# EAGLE schematic Smartenit_Board_Updated (EAGLE 8.4.1)
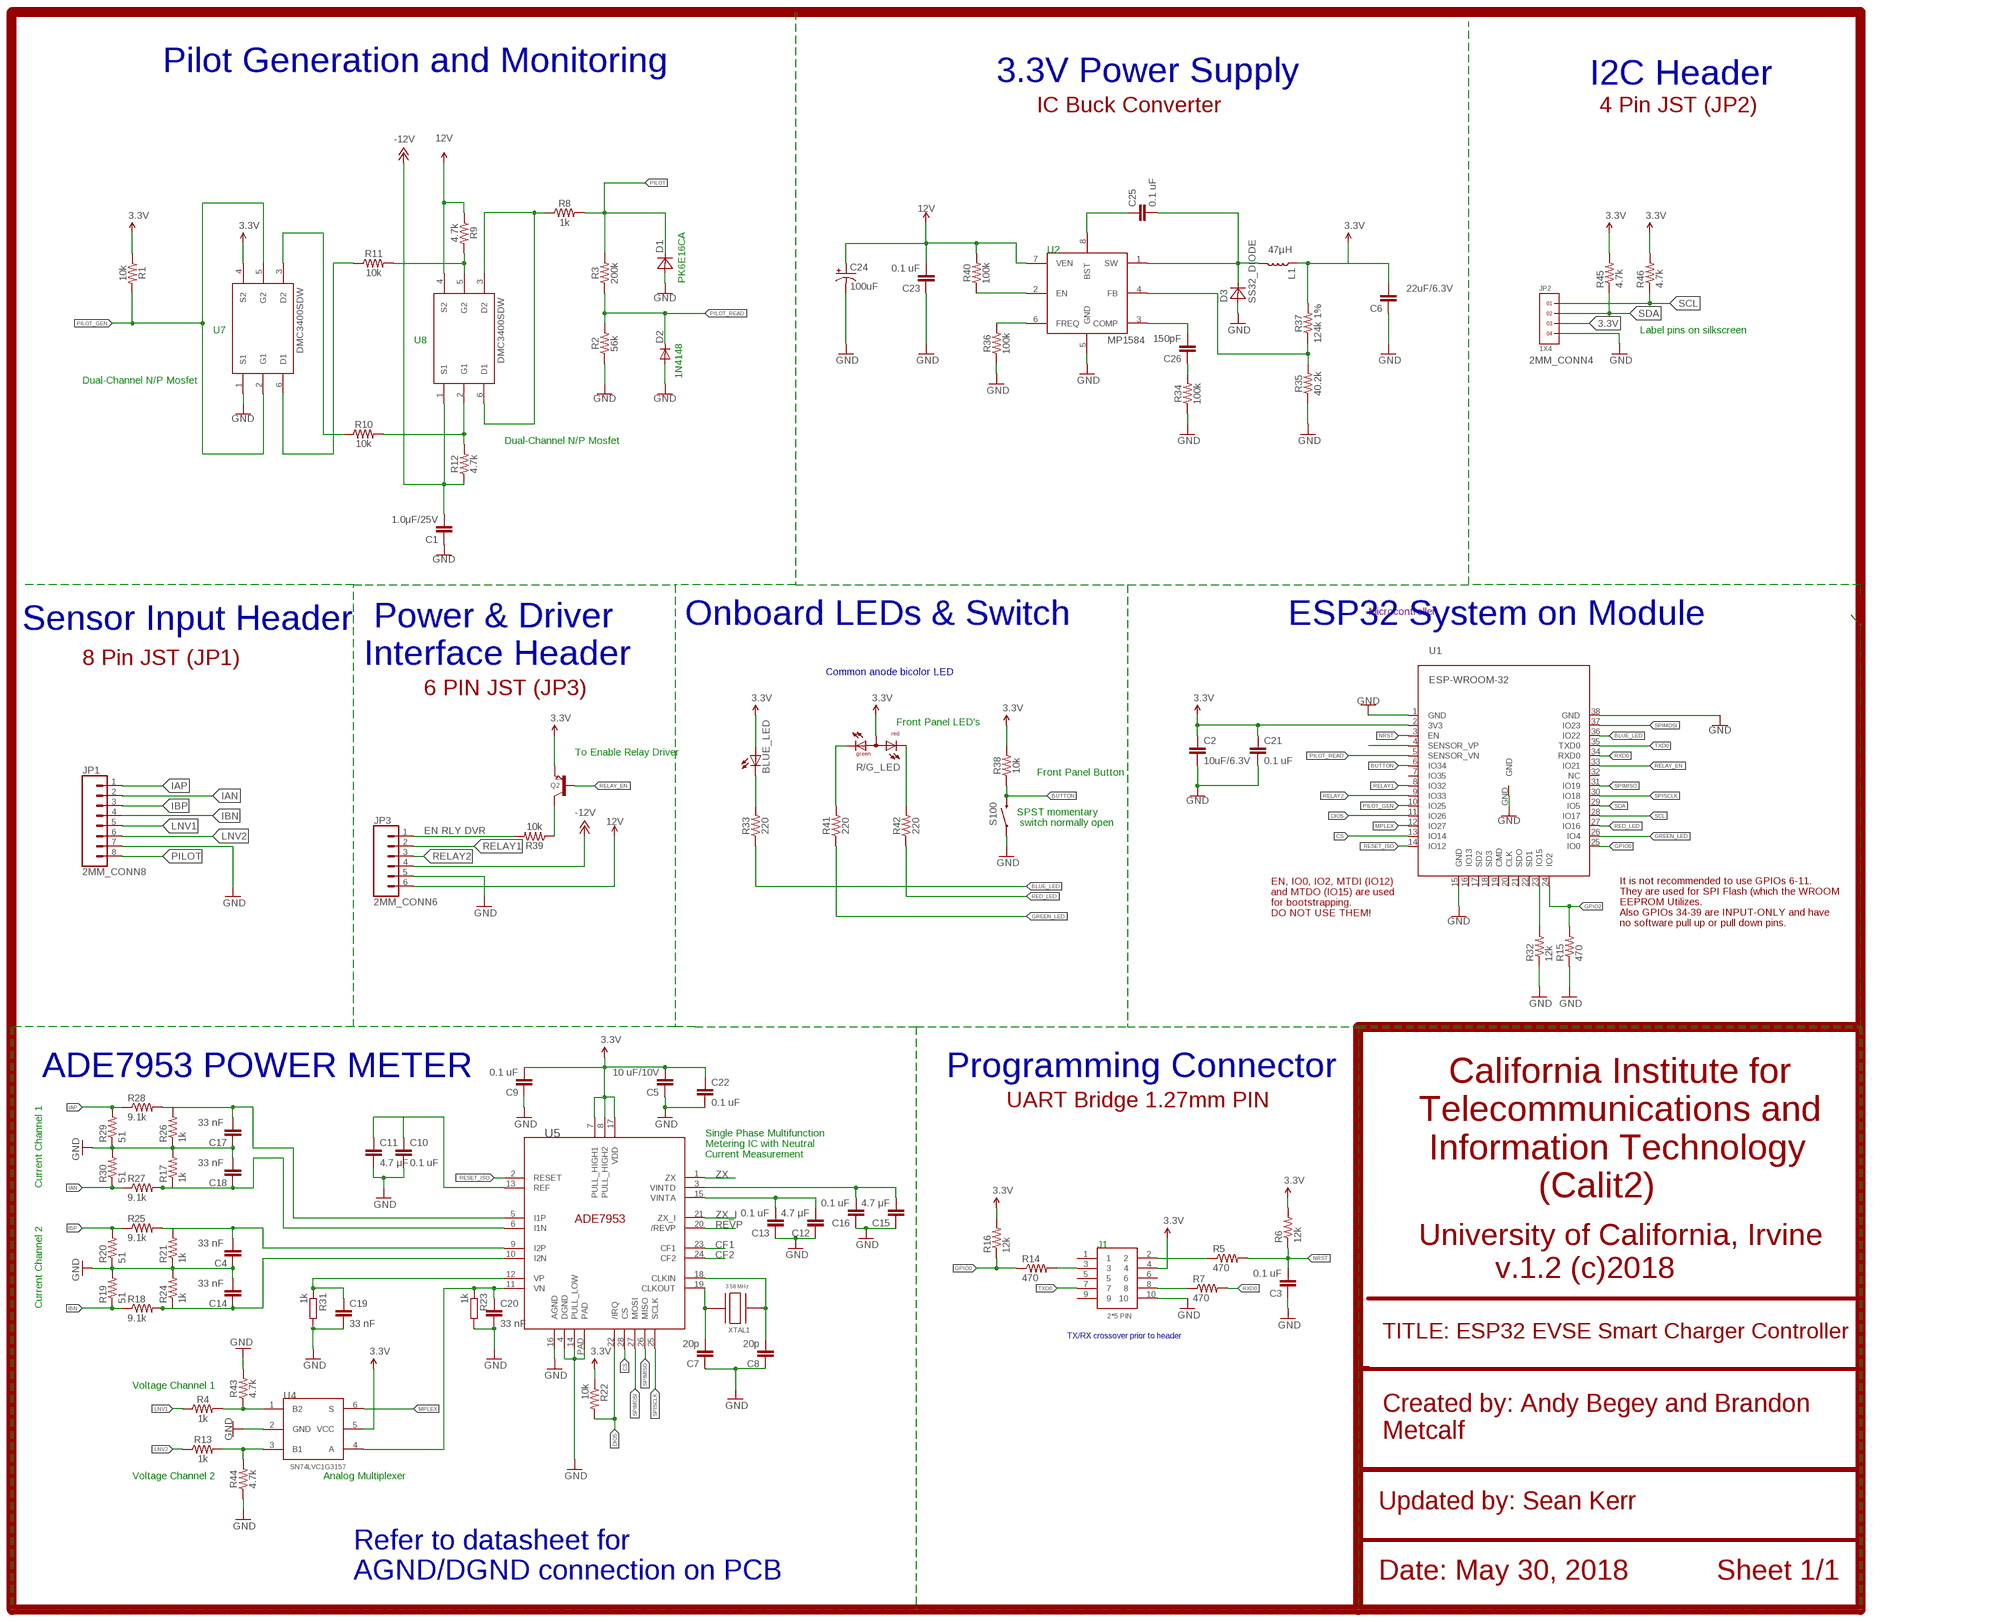
[diagram p0: schematic, sheet 1]

## Parts
BLUE_LED  LED3MM  [LED3MM]
C1  1.0μF/25V  680PF-0603-50V-10%  [0603]
C2  10uF/6.3V  CAP0805  [0805]
C3  0.1 uF  0402-CAP  [0402-CAP]
C4  33 nF  0402-CAP  [0402-CAP]
C5  10 uF/10V  0402-CAP  [0402-CAP]
C6  22uF/6.3V  680PF-0603-50V-10%  [0603]
C7  20p  0402-CAP  [0402-CAP]
C8  20p  0402-CAP  [0402-CAP]
C9  0.1 uF  0402-CAP  [0402-CAP]
C10  0.1 uF  0402-CAP  [0402-CAP]
C11  4.7 μF  0402-CAP  [0402-CAP]
C12  4.7 μF  0402-CAP  [0402-CAP]
C13  0.1 uF  0402-CAP  [0402-CAP]
C14  33 nF  0402-CAP  [0402-CAP]
C15  4.7 μF  0402-CAP  [0402-CAP]
C16  0.1 uF  0402-CAP  [0402-CAP]
C17  33 nF  0402-CAP  [0402-CAP]
C18  33 nF  0402-CAP  [0402-CAP]
C19  33 nF  C-EUC0805K  [C0805K]
C20  33 nF  C-EUC0805K  [C0805K]
C21  0.1 uF  CAP0603-CAP  [0603-CAP]
C22  0.1 uF  10UF-0805-10V-10%  [0805]
C23  0.1 uF  680PF-0603-50V-10%  [0603]
C24  100uF  CAP_POLPTH1  [CPOL-RADIAL-100UF-25V]
C25  0.1 uF  680PF-0603-50V-10%  [0603]
C26  150pF  680PF-0603-50V-10%  [0603]
D1  P6SMB16A  TVSDIODE  [D014AC]
D2  DIODESOD  [SOD-323]
D3  SS32_DIODE  [D0-214AB]
J1  2X5CONNECTOR1.27MM  [1296-10]
JP1  2MM_CONN8  [CONN82MM]
JP2  1X4  [1X4]
JP3  2MM_CONN6  [CONN6_2MM]
L1  47µH/±30%/750mA  INDUCTOR-CR54-47UH  [CR54]
Q2  PNP-TRANSISTOR_SOT23  [SOT23]
R1  10k  100KOHM-0603-1/10W-1%  [0603]
R2  56k  100KOHM-0603-1/10W-1%  [0603]
R3  200k  100KOHM-0603-1/10W-1%  [0603]
R4  1k  1KOHM-0603-1/10W-1%  [0603]
R5  470  0402-RES  [0402-RES]
R6  12k  0402-RES  [0402-RES]
R7  470  0402-RES  [0402-RES]
R8  1k  100KOHM-0603-1/10W-1%  [0603]
R9  4.7k  100KOHM-0603-1/10W-1%  [0603]
R10  10k  100KOHM-0603-1/10W-1%  [0603]
R11  10k  100KOHM-0603-1/10W-1%  [0603]
R12  4.7k  100KOHM-0603-1/10W-1%  [0603]
R13  1k  1KOHM-0603-1/10W-1%  [0603]
R14  470  0402-RES  [0402-RES]
R15  470  0402-RES  [0402-RES]
R16  12k  0402-RES  [0402-RES]
R17  1k  0402-RES  [0402-RES]
R18  9.1k  0402-RES  [0402-RES]
R19  51  0402-RES  [0402-RES]
R20  51  0402-RES  [0402-RES]
R21  1k  0402-RES  [0402-RES]
R22  10k  0402-RES  [0402-RES]
R23  1k  R-EU_0204/2V  [0204V]
R24  1k  0402-RES  [0402-RES]
R25  9.1k  0402-RES  [0402-RES]
R26  1k  0402-RES  [0402-RES]
R27  9.1k  0402-RES  [0402-RES]
R28  9.1k  0402-RES  [0402-RES]
R29  51  0402-RES  [0402-RES]
R30  51  0402-RES  [0402-RES]
R31  1k  R-EU_0204/2V  [0204V]
R32  12k  0402-RES  [0402-RES]
R33  220  10KOHM-0603-1/10W-1%  [0603]
R34  100k  100KOHM-0603-1/10W-1%  [0603]
R35  40.2k  100KOHM-0603-1/10W-1%  [0603]
R36  100k  100KOHM-0603-1/10W-1%  [0603]
R37  124k 1%  100KOHM-0603-1/10W-1%  [0603]
R38  10k  10KOHM-0603-1/10W-1%  [0603]
R39  10k  100KOHM-0603-1/10W-1%  [0603]
R40  100k  100KOHM-0603-1/10W-1%  [0603]
R41  220  10KOHM-0603-1/10W-1%  [0603]
R42  220  10KOHM-0603-1/10W-1%  [0603]
R43  4.7k  1KOHM-0603-1/10W-1%  [0603]
R44  4.7k  1KOHM-0603-1/10W-1%  [0603]
R45  4.7k  0402-RES  [0402-RES]
R46  4.7k  0402-RES  [0402-RES]
R/G_LED  DUOLED-RG-A  [DUOLED-A-5MM]
S100  SWITCH-MOMENTARY-2PTH  [TACTILE-PTH]
U1  ESP-WROOM-32  [ESP-WROOM-32]
U2  MP1584  [SOIC8]
U4  SN74LVC1G3157  [DBV-6]
U5  ADE7953  [28-WFQFN]
U7  DMC3400SSDW  [SOT363]
U55  DMC3400SSDW  [SOT363]
XTAL1  QUARTZ_3.58M_2PIN  [HC-49S]

## Nets
3.3V: BLUE_LED.A C2.1 C5.2 C6.2 C9.2 C21.1 C22.1 J1.4 JP2.3 L1.P$1 Q2.2(E) R1.1 R6.2 R16.2 R22.1 R37.2 R38.2 R45.2 R46.2 R/G_LED.A U1.2(3V3) U4.5(VCC) U5.7(PULL_HIGH1) U5.8(PULL_HIGH2) U5.17(VDD) U7.4(S2)
12V: C23.2 C24.1(+) JP3.6(PIN6) R9.1 R40.2 U2.7(VEN) U55.4(S2)
-12V: C1.2 JP3.4(PIN4) R12.1 U55.1(S1)
AGND: C4.1 C10.2 C11.2 C12.1 C13.1 C14.2 C17.1 C18.2 C19.2 C20.2 R17.2 R19.2 R20.1 R21.1 R23.2 R24.2 R26.1 R29.1 R30.2 R31.2 U4.2(GND) U5.16(AGND) ; supply symbol labelled GND
BLUE_LED: R33.1 U1.36(IO22)
BUTTON: R38.1 S100.3 U1.6(IO34)
CF1: U5.23(CF1)
CF2: U5.24(CF2)
CS: U1.13(IO14) U5.28(CS)
DGND: C1.1 C2.2 C3.1 C5.1 C6.1 C7.1 C8.1 C9.1 C15.1 C16.1 C21.2 C22.2 C23.1 C24.2(-) D1.P D2.2(A) J1.10 JP3.5(PIN5) R2.1 R15.1 R32.1 R34.1 R35.1 R36.1 R43.2 R44.1 S100.1 U1.1(GND) U1.15(GND) U1.GND U2.5(GND) U5.4(DGND) U5.14(PULL_LOW) U5.PAD U7.1(S1) ; supply symbol labelled GND
DIO5: R22.2 U1.11(IO26) U5.22(/IRQ)
FRGGN: R32.2 U1.23(IO15)
GND: D3.P JP1.7 JP2.4 U1.38(GND)
GPIO0: R14.1 R16.1 U1.25(IO0)
GPIO2: R15.2 U1.24(IO2)
GREEN_LED: R41.1 U1.26(IO4)
IAN: JP1.2 R27.1 R30.1
IAP: JP1.1 R28.1 R29.2
IBN: JP1.4 R18.1 R19.1
IBP: JP1.3 R20.2 R25.1
LNV1: JP1.5 R4.1
LNV2: JP1.6 R13.1
MPLEX: U1.12(IO27) U4.6(S)
N$1: C7.2 U5.19(CLKOUT) XTAL1.1
N$2: C8.2 U5.18(CLKIN) XTAL1.2
N$3 [ic]: C20.1 R23.1 U4.4(A) U5.11(VN)
N$4: R36.2 U2.6(FREQ)
N$5: C4.2 R21.2 R25.2 U5.9(I2P)
N$7: C10.1 C11.1 U5.13(REF)
N$8: C12.2 C13.2 U5.15(VINTA)
N$10: R4.2 R43.1 U4.1(B2)
N$11: C14.1 R18.2 R24.1 U5.10(I2N)
N$12: C15.2 C16.2 U5.3(VINTD)
N$13: R13.2 R44.2 U4.3(B1)
N$14: R40.1 U2.2(EN)
N$15: C26.2 U2.3(COMP)
N$17: C26.1 R34.2
N$18: C25.2 D3.N L1.P$2 U2.1(SW)
N$19: R35.2 R37.1 U2.4(FB)
N$20: Q2.3(C) R39.1
N$21: BLUE_LED.K(C) R33.2
N$22: C25.1 U2.8(BST)
N$23: R9.2 R11.2 U55.5(G2)
N$24: C17.2 R26.2 R28.2 U5.5(I1P)
N$25: R41.2 R/G_LED.CX(CG)
N$26: R42.2 R/G_LED.CR
N$27: C18.1 R17.1 R27.2 U5.6(I1N)
N$28: R10.1 U7.3(D2)
N$29: R10.2 R12.2 U55.2(G1)
N$32: R11.1 U7.6(D1)
N$33: R8.1 U55.3(D2) U55.6(D1)
N$38: JP3.1(PIN1) R39.2
N$40: J1.3 R14.2
N$47: U1.4(SENSOR_VP)
N$62: J1.2 R5.1
N$65: J1.8 R7.1
NRST: C3.2 R5.2 R6.1 U1.3(EN)
PILOT: D1.N JP1.8 R3.2 R8.2
PILOT_GEN: R1.2 U1.10(IO25) U7.2(G1) U7.5(G2)
PILOT_READ: D2.1(C) R2.2 R3.1 U1.5(SENSOR_VN)
RED_LED: R42.1 U1.27(IO16)
RELAY1: JP3.2(PIN2) U1.8(IO32)
RELAY2: JP3.3(PIN3) U1.9(IO33)
RELAY_EN: Q2.1(B) U1.33(IO21)
RESET_ISO: U1.14(IO12) U5.2(RESET)
REVP: U5.20(/REVP)
RXD0: R7.2 U1.34(RXD0)
SCL: JP2.1 R46.1 U1.28(IO17)
SDA: JP2.2 R45.1 U1.29(IO5)
SPIMISO: U1.31(IO19) U5.26(MISO)
SPIMOSI: U1.37(IO23) U5.27(MOSI)
SPISCLK: U1.30(IO18) U5.25(SCLK)
TXD0: J1.7 U1.35(TXD0)
V2P [ic]: C19.1 R31.1 U5.12(VP)
ZX: U5.1(ZX)
ZX_I: U5.21(ZX_I)
Unconnected: J1.1 J1.5 J1.6 J1.9 U1.7(IO35) U1.16(IO13) U1.17(SD2) U1.18(SD3) U1.19(CMD) U1.20(CLK) U1.21(SDO) U1.22(SD1) U1.32(NC)

## Notes on the sheet
- Pilot Generation and Monitoring
- 3.3V Power Supply
- IC Buck Converter | 4 Pin JST (JP2)
- I2C Header
- U2 | 47µH
- PK6E16CA
- U7 | Label pins on silkscreen
- U8 | 1N4148
- 2MM_CONN4
- Dual-Channel N/P Mosfet
- Dual-Channel N/P Mosfet
- Microcontroller
- Onboard LEDs & Switch | ESP32 | ESP32 System on Module
- 8 Pin JST (JP1)
- Power & Driver 
  Interface Header
- Common anode bicolor LED
- 6 PIN JST (JP3)
- Sensor Input Header
- Front Panel LED's
- To Enable Relay Driver
- Front Panel Button
- Q2
- SPST momentary
   switch normally open
- EN RLY DVR
- EN, IO0, IO2, MTDI (IO12)
   and MTDO (IO15) are used
   for bootstrapping. 
   DO NOT USE THEM!
- It is not recommended to use GPIOs 6-11.
  They are used for SPI Flash (which the WROOM
  EEPROM Utilizes.
  Also GPIOs 34-39 are INPUT-ONLY and have
  no software pull up or pull down pins.
- ADE7953 POWER METER | Programming Connector
- UART Bridge 1.27mm PIN
- Single Phase Multifunction
  Metering IC with Neutral
  Current Measurement
- Current Channel 1
- California Institute for
   Telecommunications and 
    Information Technology
               (Calit2)
- J1
- University of California, Irvine 
           v.1.2 (c)2018
- 3.58 MHz
- Current Channel 2
- TX/RX crossover prior to header | TITLE: ESP32 EVSE Smart Charger Controller
- Voltage Channel 1
- Created by: Andy Begey and Brandon 
  Metcalf
- Voltage Channel 2 | Analog Multiplexer
- Updated by: Sean Kerr
- Refer to datasheet for 
  AGND/DGND connection on PCB
- Date: May 30, 2018           Sheet 1/1

## Library data of the parts
BLUE_LED = SparkFun:LED: LEDs Standard schematic elements and footprints for 5mm, 3mm, 1206, and 0603 sized LEDs. 5mm - Spark Fun Electronics SKU : COM-00529 (and others)
C1 C6 C23 C25 C26 = SparkFun-Capacitors:680PF: 680pF/0.68nF ceramic capacitors A capacitor is a passive two-terminal electrical component used to store electrical energy temporarily in an electric field.; PROD_ID: CAP-09232; VALUE: 680pF
C2 C21 = SparkFun:CAP: Capacitor Standard 0603 ceramic capacitor, and 0.1" leaded capacitor.
C3-C5 C7-C18 = Nizanlib:0402-CAP
C19 C20 = resistor:C-EU: CAPACITOR, European symbol
C22 = SparkFun-Capacitors:10UF: 10.0µF ceramic capacitors A capacitor is a passive two-terminal electrical component used to store electrical energy temporarily in an electric field.; PROD_ID: CAP-11330; VALUE: 10uF
C24 = SparkFun:CAP_POL: Capacitor Polarized These are standard SMD and PTH capacitors. Normally 10uF, 47uF, and 100uF in electrolytic and tantalum varieties. Always verify the external diameter of the through hole cap, it varies with capacity, voltage, and manufacturer. The EIA devices should be standard.
D1 = Smart_Charger:TVSDIODE
D2 = SparkFun:DIODE: Diode These are standard reverse protection diodes and small signal diodes. SMA package can handle up to about 1A. SOD-323 can handle about 200mA. What the SOD-323 package when ordering, there are some mfgs out there that are 5-pin packages.
D3 = Smart_Charger:SS32_DIODE
J1 = Smart_Charger:2X5CONNECTOR1.27MM
JP1 = Smart_Charger:2MM_CONN8
JP2 = headers(2mm):1X4
JP3 = Smart_Charger:2MM_CONN6
L1 = SparkFun-Coils:INDUCTOR: Inductors Resist changes in electrical current. Basically a coil of wire. SparkFun Products: SparkFun Load Cell Amplifier - HX711 <https://www.sparkfun.com/products/13879> IOIO-OTG - V2.2 <https://www.sparkfun.com/products/13613>; PROD_ID: NDUC-10789
Q2 = semicon-smd-ipc:PNP-TRANSISTOR_: PNP TRANSISTOR
R1-R3 R8-R12 R35 R37 R39 = SparkFun-Resistors:100KOHM: 100kΩ resistor A resistor is a passive two-terminal electrical component that implements electrical resistance as a circuit element. Resistors act to reduce current flow, and, at the same time, act to lower voltage levels within circuits. - Wikipedia; PROD_ID: RES-07828; VALUE: 100k
R4 R13 = SparkFun-Resistors:1KOHM: 1kΩ resistor A resistor is a passive two-terminal electrical component that implements electrical resistance as a circuit element. Resistors act to reduce current flow, and, at the same time, act to lower voltage levels within circuits. - Wikipedia; PROD_ID: RES-07856
R5-R7 R14-R22 R24-R30 R32 R45 R46 = Nizanlib:0402-RES
R23 R31 = resistor:R-EU_: RESISTOR, European symbol
R33 R41 R42 = SparkFun-Resistors:10KOHM: 10kΩ resistor A resistor is a passive two-terminal electrical component that implements electrical resistance as a circuit element. Resistors act to reduce current flow, and, at the same time, act to lower voltage levels within circuits. - Wikipedia; PROD_ID: RES-00824; VALUE: 10k
R34 R36 R40 = SparkFun-Resistors:100KOHM: 100kΩ resistor A resistor is a passive two-terminal electrical component that implements electrical resistance as a circuit element. Resistors act to reduce current flow, and, at the same time, act to lower voltage levels within circuits. - Wikipedia; PROD_ID: RES-07828
R38 = SparkFun-Resistors:10KOHM: 10kΩ resistor A resistor is a passive two-terminal electrical component that implements electrical resistance as a circuit element. Resistors act to reduce current flow, and, at the same time, act to lower voltage levels within circuits. - Wikipedia; PROD_ID: RES-00824
R43 R44 = SparkFun-Resistors:1KOHM: 1kΩ resistor A resistor is a passive two-terminal electrical component that implements electrical resistance as a circuit element. Resistors act to reduce current flow, and, at the same time, act to lower voltage levels within circuits. - Wikipedia; PROD_ID: RES-07856; VALUE: 1k
R/G_LED = led:DUOLED-RG-A: DUO LED 2 colors (red/green), 5 mm, round, common Anode www.ligitek.com or other producers.
S100 = SparkFun:SWITCH-MOMENTARY-2
U1 = esp32:ESP-WROOM-32
U2 = Smart_Charger:MP1584
U4 = Smart_Charger:SN74LVC1G3157
U5 = CalPlug:ADE7953
U7 U55 = Smart_Charger:DMC3400SSDW
XTAL1 = CalPlug:QUARTZ_3.58M_2PIN; DIGIKEY: http://www.digikey.com/product-detail/en/txc-corporation/9C-3.579545MBBK-T/887-2450-1-ND/4475440

## Net classes
1 HIGHVOLTAGE: width 0.254 mm, drill 0.508 mm, clearance 2.413 mm to class 0, clearance 0.152 mm
2 ic: width 0.152 mm, drill 0.305 mm, clearance 0.205 mm to class 0, clearance 2.413 mm to class 1, clearance 0.205 mm